# Altium schematic sheet EQ.SchDoc
size A4
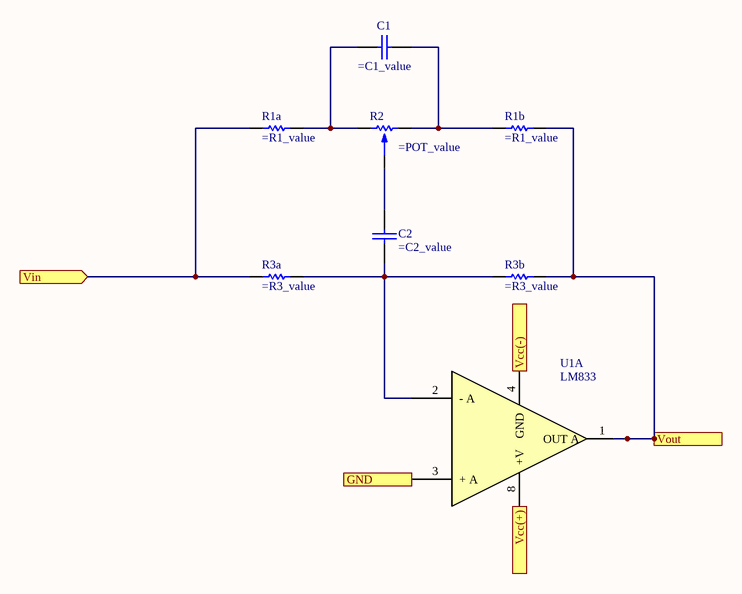
[diagram p0: EQ.SchDoc]

## Parts
C1  (no value)  [0805]
C2  (no value)  [0805]
R1a  (no value)  [0805]
R1b  (no value)  [0805]
R2  (no value)  [POTENCIOMETRO]
R3a  (no value)  [0805]
R3b  (no value)  [0805]
U1  LM833  [DIP8]  (part A of 2)

## Ports
GND, Vcc(+) (in), Vcc(-) (in), Vin (in), Vout (out)

## Nets
GND: U1.3(+_A) ; port GND
Vcc(+): U1.8(+V) ; port Vcc(+)
Vcc(-): U1.4(GND) ; port Vcc(-)
Vin: R1a.1 R3a.1 ; port Vin
Vout: R1b.2 R3b.2 U1.1(OUT_A) ; port Vout
NetC1_1: C1.1 R1a.2 R2.3
NetC1_2: C1.2 R1b.1 R2.1
NetC2_1: C2.1 R2.2
NetC2_2: C2.2 R3a.2 R3b.1 U1.2(-_A)

## Library data of the parts
C1 C2 = CAP
R1a R1b R3a R3b = RES
R2 = POTENCIOMETRO
U1 = LM833: Dual Audio Operational Amplifier